# Altium project MZCAT_color_sensor.PrjPcb
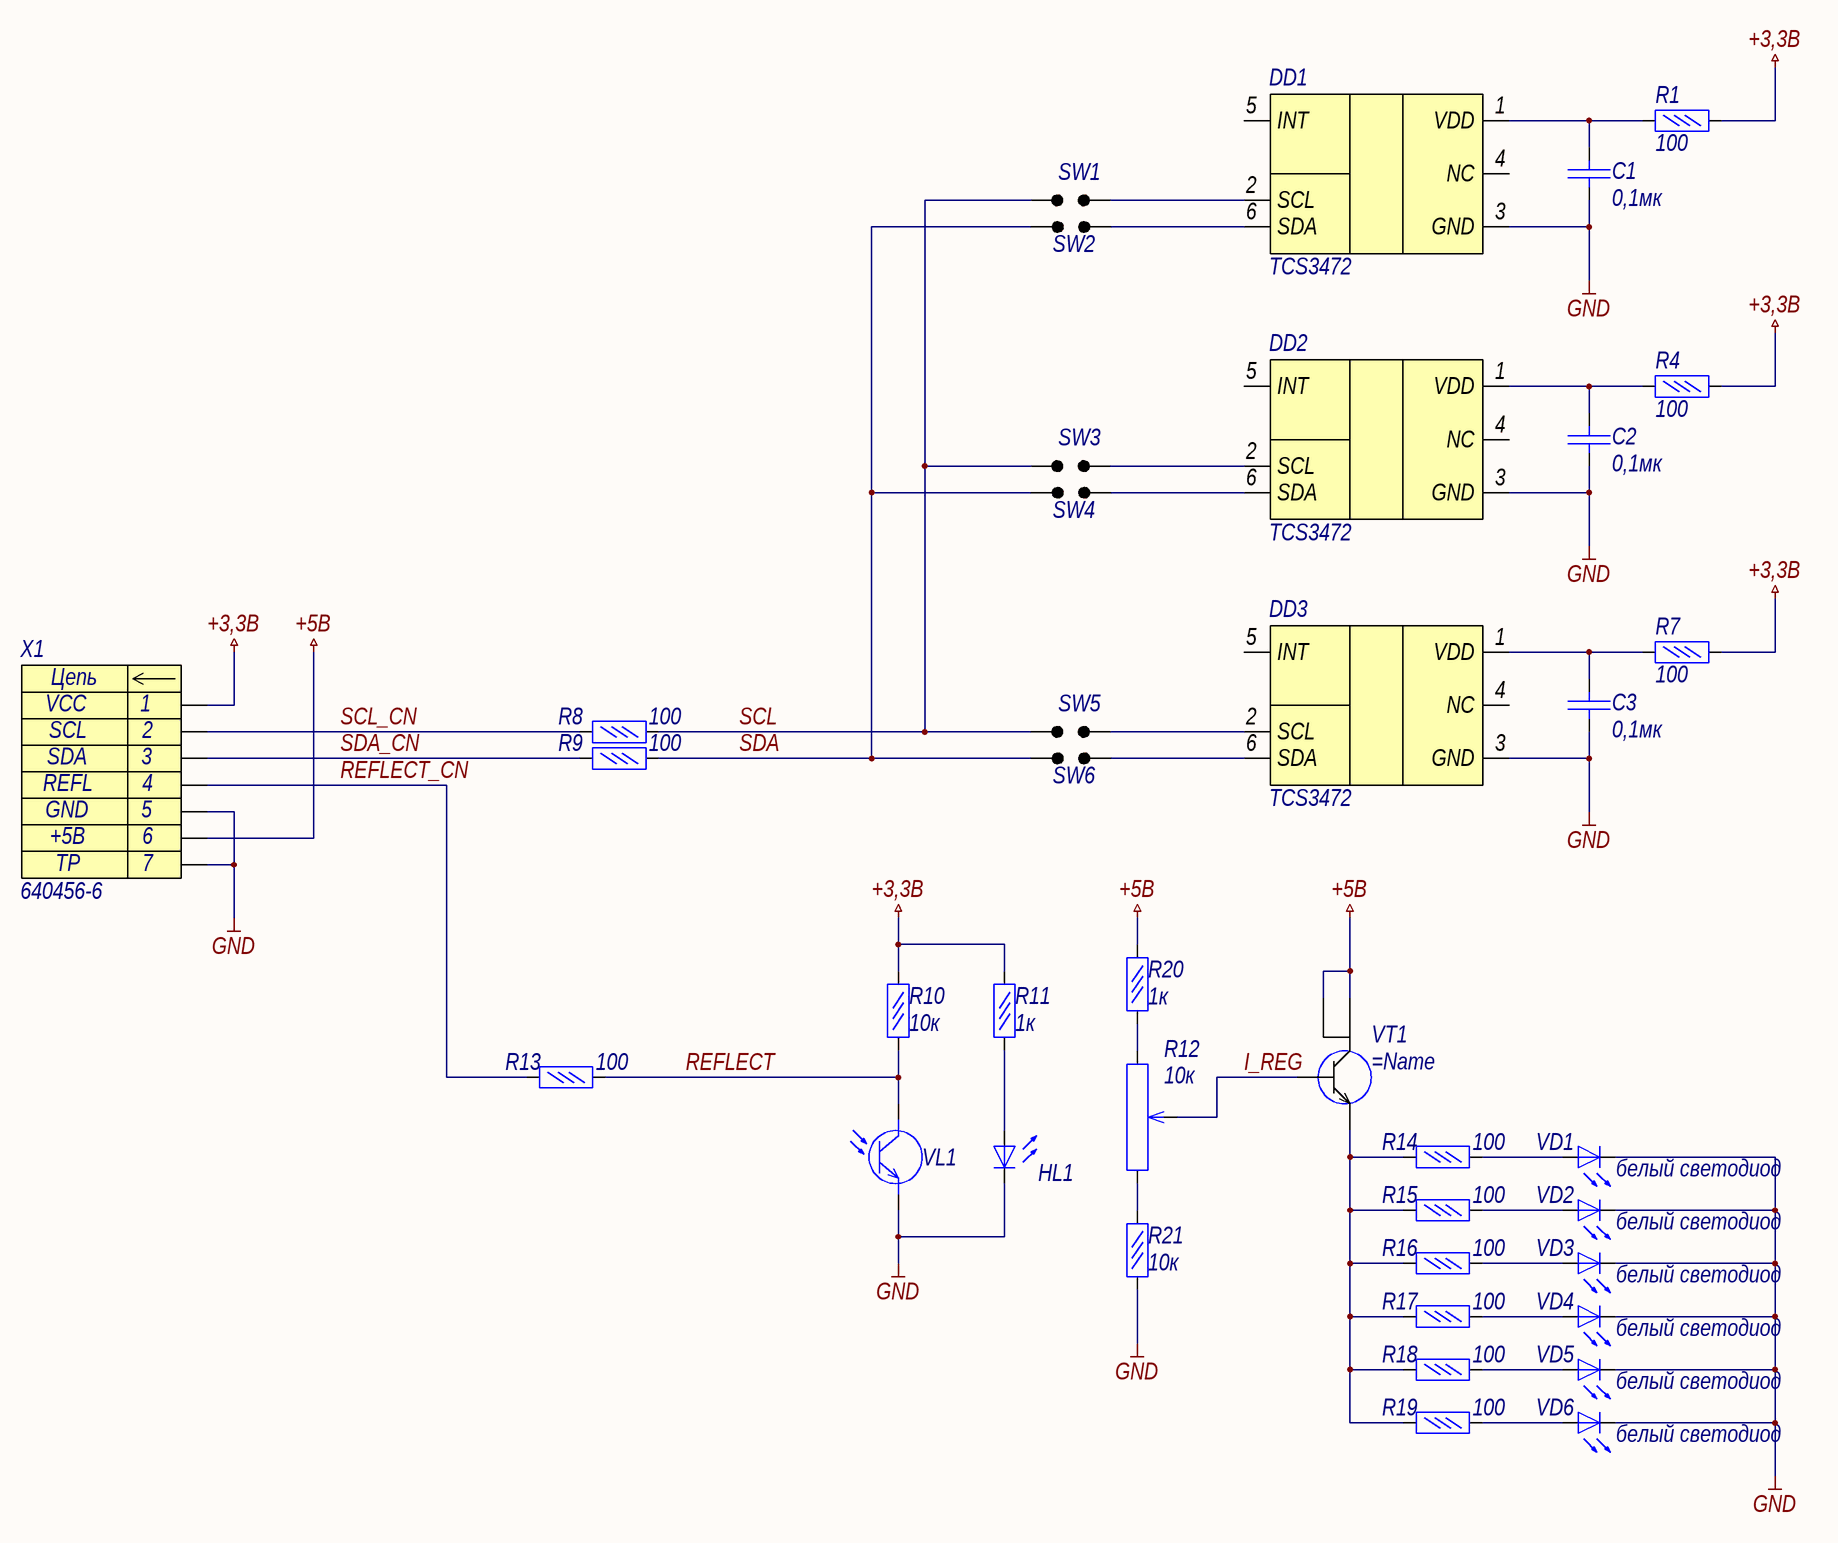
[diagram p0: MZCAT_color_sensor.SchDoc]
1 sheet, 39 parts. Net scope: global (net labels, ports and power ports of the same name join across sheets).
Board file: MZCAT_color_sensor.PcbDoc

## Sheet MZCAT_color_sensor.SchDoc
size 594 x 420 mm; SheetNumber: 1; SheetTotal: 1

### Parts
DD1  TCS3472  [TCS3472]
DD2  TCS3472  [TCS3472]
DD3  TCS3472  [TCS3472]
HL1  (no value)  [LED 5mm]
R1  100  [R0603]
R4  100  [R0603]
R7  100  [R0603]
R8  100  [R0603]
R9  100  [R0603]
R10  10к  [R0603]
R11  1к  [R0603]
R12  10к  [35W potentiometer]
R13  100  [R0603]
R14  100  [R0603]
R15  100  [R0603]
R16  100  [R0603]
R17  100  [R0603]
R18  100  [R0603]
R19  100  [R0603]
R20  1к  [R0603]
R21  10к  [R0603]
SW1  (no value)  [JUMPER_SOLDERED_3x1]
SW2  (no value)  [JUMPER_SOLDERED_3x1]
SW3  (no value)  [JUMPER_SOLDERED_3x1]
SW4  (no value)  [JUMPER_SOLDERED_3x1]
SW5  (no value)  [JUMPER_SOLDERED_3x1]
SW6  (no value)  [JUMPER_SOLDERED_3x1]
VD1  белый светодиод  [2835 led]
VD2  белый светодиод  [2835 led]
VD3  белый светодиод  [2835 led]
VD4  белый светодиод  [2835 led]
VD5  белый светодиод  [2835 led]
VD6  белый светодиод  [2835 led]
VL1  (no value)  [LED 5mm]
VT1  (no value)  [SOT-223]
X1  640456-6  [LCP 6 pin]
С1  0,1мк  [C0603]
С2  0,1мк  [C0603]
С3  0,1мк  [C0603]

### Nets
+3,3В: R1.2 R4.2 R7.2 R10.2 R11.2 X1.1
+5В: R20.2 VT1.2(collector) VT1.4(collector) X1.6
GND: DD1.3(GND) DD2.3(GND) DD3.3(GND) HL1.2(K) R21.1 VD1.2(K) VD2.2(K) VD3.2(K) VD4.2(K) VD5.2(K) VD6.2(K) VL1.2(E) X1.0 X1.5 С1.1 С2.1 С3.1
I_REG: R12.3 VT1.1(base)
REFLECT: R10.1 R13.2 VL1.1(C)
REFLECT_CN: R13.1 X1.4
SCL: R8.2 SW1.1 SW3.1 SW5.1
SCL_CN: R8.1 X1.2
SDA: R9.2 SW2.1 SW4.1 SW6.1
SDA_CN: R9.1 X1.3
NetDD1_1: DD1.1(VDD) R1.1 С1.2
NetDD1_2: DD1.2(SCL) SW1.2
NetDD1_6: DD1.6(SDA) SW2.2
NetDD2_1: DD2.1(VDD) R4.1 С2.2
NetDD2_2: DD2.2(SCL) SW3.2
NetDD2_6: DD2.6(SDA) SW4.2
NetDD3_1: DD3.1(VDD) R7.1 С3.2
NetDD3_2: DD3.2(SCL) SW5.2
NetDD3_6: DD3.6(SDA) SW6.2
NetHL1_1: HL1.1(A) R11.1
NetR12_1: R12.1 R20.1
NetR12_2: R12.2 R21.2
NetR14_1: R14.1 R15.1 R16.1 R17.1 R18.1 R19.1 VT1.3(emitter)
NetR14_2: R14.2 VD1.1(A)
NetR15_2: R15.2 VD2.1(A)
NetR16_2: R16.2 VD3.1(A)
NetR17_2: R17.2 VD4.1(A)
NetR18_2: R18.2 VD5.1(A)
NetR19_2: R19.2 VD6.1(A)

Not connected (* = marked no-connect by the designer): DD1 4(NC) 5(INT); DD2 4(NC) 5(INT); DD3 4(NC) 5(INT)

### Notes on the sheet
- Перв. примен.
- Справ. №
- Подп. и дата
- Инв. № дубл.
- Нормоконтроль:
- Взам. инв. №
- Изм.
- Лист
- № докум.
- Подп.
- Дата
- Лит.
- Масса
- Масштаб
- Т.контр.
- Пров.
- Разраб.
- Листов
- Разработал:
- Инв. № подл.
- Н.контр.
- Утв.
- Копировал
- Формат
- А2
- (in symbol Header_6) Цепь; 7

### Library data of the parts
HL1 = ИК светодиод: инфракрасный светодиод
R1 R4 R7-R11 R13-R21 = Резистор 0.05Вт: Резистор 0,05Вт
  R1 R4 R7-R9 R13-R19: Value: 100
  R10 R21: Value: 10к
  R11 R20: Value: 1к
R12 = потенциометр SMD: Value: 10к
SW1-SW6 = jumper: Запаиваемая перемычка
VD1-VD6 = SMD светодиод: Светодтод SMD; Name: белый светодиод
VL1 = фототранзистор
VT1 = PBSS4540Z: Биполярный транзистор, NPN, 40 В, 5 А, 2 Вт
X1 = Header_6: Разъем - 6 конт. мама; Contact_1: VCC; Contact_2: SCL; Contact_3: SDA; Contact_4: REFL; Contact_5: GND; Contact_6: +5В; Contact_7: TP; Name: 640456-6
С1-С3 = Кер. конденсатор: Value: 0,1мк
DD1-DD3 = TCS3472: Name: TCS3472